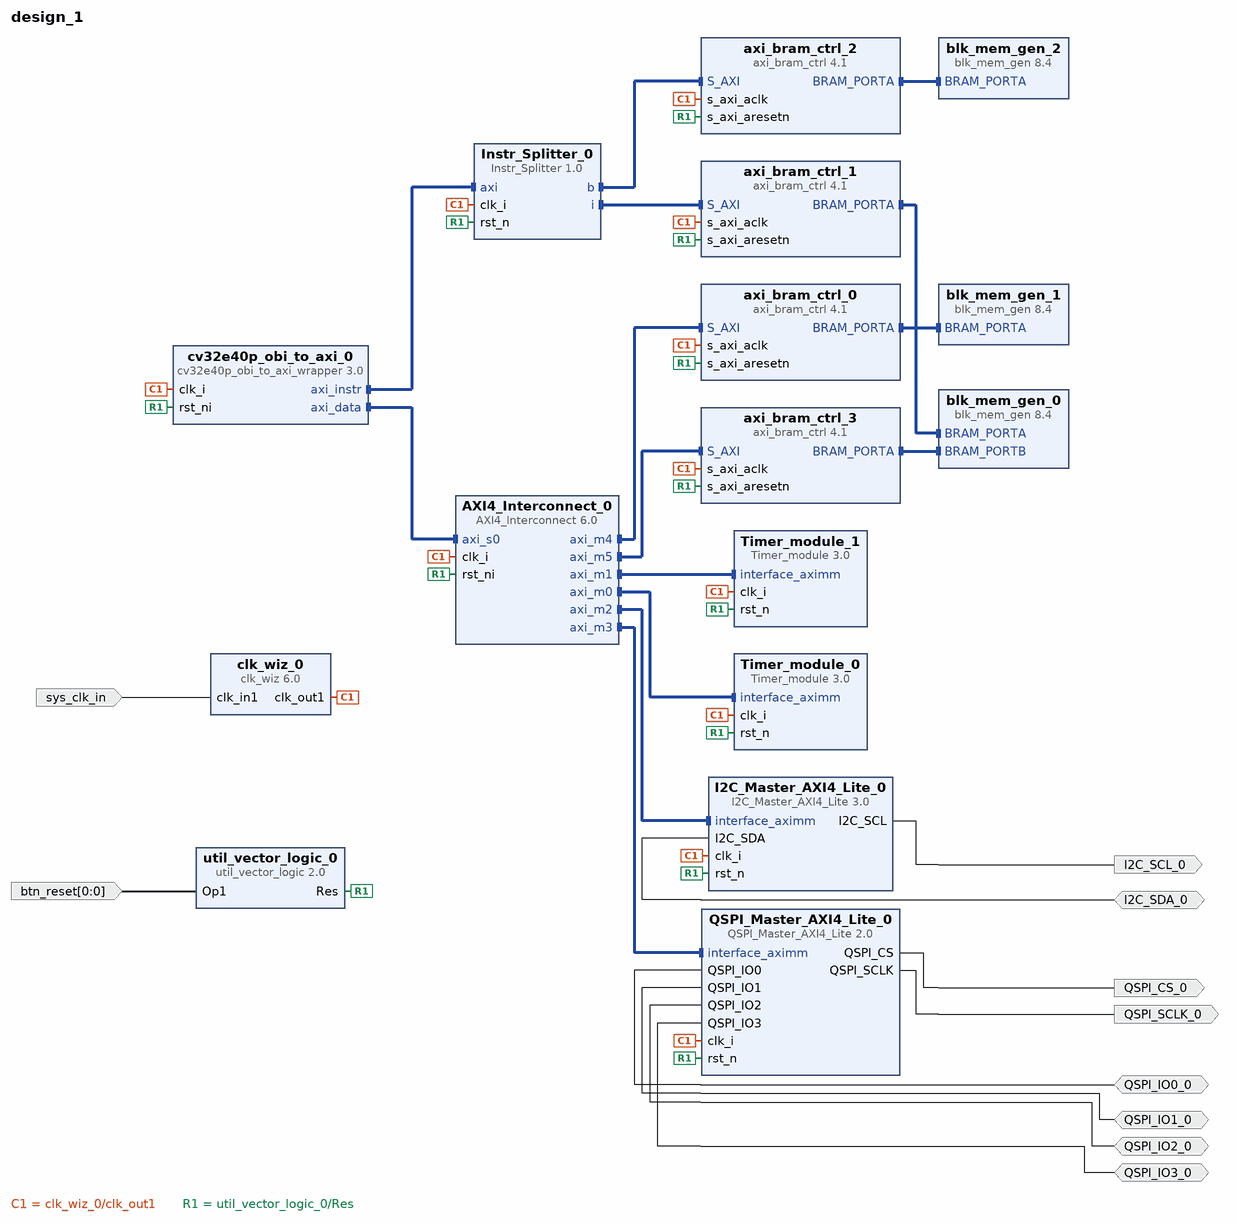
[diagram p0: block diagram of the top level]
# Vivado block design design_1, xc7a35tcpg236-1, Vivado 2025.2
create_bd_design design_1

create_bd_port -dir I -type clk sys_clk_in
create_bd_port -dir I -from 0 -to 0 btn_reset
create_bd_port -dir O I2C_SCL_0
create_bd_port -dir IO I2C_SDA_0
create_bd_port -dir O QSPI_SCLK_0
create_bd_port -dir O QSPI_CS_0
create_bd_port -dir IO QSPI_IO0_0
create_bd_port -dir IO QSPI_IO1_0
create_bd_port -dir IO QSPI_IO2_0
create_bd_port -dir IO QSPI_IO3_0

create_bd_cell -type ip -vlnv kyber:user:cv32e40p_obi_to_axi_wrapper:3.0 cv32e40p_obi_to_axi_0
set_property -dict {CONFIG.boot_addr 0x00000000} [get_bd_cells cv32e40p_obi_to_axi_0]
create_bd_cell -type ip -vlnv kyber:user:AXI4_Interconnect:6.0 AXI4_Interconnect_0
create_bd_cell -type ip -vlnv xilinx.com:ip:axi_bram_ctrl:4.1 axi_bram_ctrl_0
set_property -dict {CONFIG.SINGLE_PORT_BRAM 1} [get_bd_cells axi_bram_ctrl_0]
create_bd_cell -type ip -vlnv xilinx.com:ip:axi_bram_ctrl:4.1 axi_bram_ctrl_1
set_property -dict {CONFIG.SINGLE_PORT_BRAM 1} [get_bd_cells axi_bram_ctrl_1]
create_bd_cell -type ip -vlnv kyber:user:QSPI_Master_AXI4_Lite:2.0 QSPI_Master_AXI4_Lite_0
create_bd_cell -type ip -vlnv kyber:user:I2C_Master_AXI4_Lite:3.0 I2C_Master_AXI4_Lite_0
create_bd_cell -type ip -vlnv kyber:user:Timer_module:3.0 Timer_module_0
create_bd_cell -type ip -vlnv xilinx.com:ip:clk_wiz:6.0 clk_wiz_0
set_property -dict [list \
  CONFIG.CLKOUT1_JITTER 151.636 \
  CONFIG.CLKOUT1_REQUESTED_OUT_FREQ 50.000 \
  CONFIG.MMCM_CLKOUT0_DIVIDE_F 20.000 \
  CONFIG.USE_LOCKED false \
  CONFIG.USE_RESET false \
] [get_bd_cells clk_wiz_0]
create_bd_cell -type ip -vlnv xilinx.com:ip:util_vector_logic:2.0 util_vector_logic_0
set_property -dict {CONFIG.C_OPERATION not CONFIG.C_SIZE 1} [get_bd_cells util_vector_logic_0]
create_bd_cell -type ip -vlnv xilinx.com:ip:blk_mem_gen:8.4 blk_mem_gen_0
set_property -dict {CONFIG.Memory_Type True_Dual_Port_RAM} [get_bd_cells blk_mem_gen_0]
create_bd_cell -type ip -vlnv xilinx.com:ip:blk_mem_gen:8.4 blk_mem_gen_1
create_bd_cell -type ip -vlnv kyber:user:Instr_Splitter:1.0 Instr_Splitter_0
create_bd_cell -type ip -vlnv xilinx.com:ip:axi_bram_ctrl:4.1 axi_bram_ctrl_2
set_property -dict {CONFIG.PROTOCOL AXI4 CONFIG.SINGLE_PORT_BRAM 1} [get_bd_cells axi_bram_ctrl_2]
create_bd_cell -type ip -vlnv xilinx.com:ip:blk_mem_gen:8.4 blk_mem_gen_2
create_bd_cell -type ip -vlnv xilinx.com:ip:axi_bram_ctrl:4.1 axi_bram_ctrl_3
set_property -dict {CONFIG.PROTOCOL AXI4 CONFIG.SINGLE_PORT_BRAM 1} [get_bd_cells axi_bram_ctrl_3]
create_bd_cell -type ip -vlnv kyber:user:Timer_module:3.0 Timer_module_1

# ---- connections ----

connect_bd_intf_net [get_bd_intf_pins Timer_module_0/interface_aximm] [get_bd_intf_pins AXI4_Interconnect_0/axi_m0]
connect_bd_intf_net [get_bd_intf_pins Timer_module_1/interface_aximm] [get_bd_intf_pins AXI4_Interconnect_0/axi_m1]
connect_bd_intf_net [get_bd_intf_pins I2C_Master_AXI4_Lite_0/interface_aximm] [get_bd_intf_pins AXI4_Interconnect_0/axi_m2]
connect_bd_intf_net [get_bd_intf_pins QSPI_Master_AXI4_Lite_0/interface_aximm] [get_bd_intf_pins AXI4_Interconnect_0/axi_m3]
connect_bd_intf_net [get_bd_intf_pins AXI4_Interconnect_0/axi_m4] [get_bd_intf_pins axi_bram_ctrl_0/S_AXI]
connect_bd_intf_net [get_bd_intf_pins axi_bram_ctrl_3/S_AXI] [get_bd_intf_pins AXI4_Interconnect_0/axi_m5]
connect_bd_intf_net [get_bd_intf_pins Instr_Splitter_0/b] [get_bd_intf_pins axi_bram_ctrl_2/S_AXI]
connect_bd_intf_net [get_bd_intf_pins Instr_Splitter_0/i] [get_bd_intf_pins axi_bram_ctrl_1/S_AXI]
connect_bd_intf_net [get_bd_intf_pins blk_mem_gen_1/BRAM_PORTA] [get_bd_intf_pins axi_bram_ctrl_0/BRAM_PORTA]
connect_bd_intf_net [get_bd_intf_pins blk_mem_gen_0/BRAM_PORTA] [get_bd_intf_pins axi_bram_ctrl_1/BRAM_PORTA]
connect_bd_intf_net [get_bd_intf_pins axi_bram_ctrl_2/BRAM_PORTA] [get_bd_intf_pins blk_mem_gen_2/BRAM_PORTA]
connect_bd_intf_net [get_bd_intf_pins axi_bram_ctrl_3/BRAM_PORTA] [get_bd_intf_pins blk_mem_gen_0/BRAM_PORTB]
connect_bd_intf_net [get_bd_intf_pins cv32e40p_obi_to_axi_0/axi_data] [get_bd_intf_pins AXI4_Interconnect_0/axi_s0]
connect_bd_intf_net [get_bd_intf_pins Instr_Splitter_0/axi] [get_bd_intf_pins cv32e40p_obi_to_axi_0/axi_instr]
connect_bd_net [get_bd_pins I2C_Master_AXI4_Lite_0/I2C_SCL] [get_bd_ports I2C_SCL_0]
connect_bd_net [get_bd_pins clk_wiz_0/clk_out1] \
  [get_bd_pins axi_bram_ctrl_1/s_axi_aclk] [get_bd_pins I2C_Master_AXI4_Lite_0/clk_i] \
  [get_bd_pins QSPI_Master_AXI4_Lite_0/clk_i] [get_bd_pins cv32e40p_obi_to_axi_0/clk_i] \
  [get_bd_pins axi_bram_ctrl_2/s_axi_aclk] [get_bd_pins Instr_Splitter_0/clk_i] [get_bd_pins axi_bram_ctrl_3/s_axi_aclk] \
  [get_bd_pins Timer_module_0/clk_i] [get_bd_pins Timer_module_1/clk_i] [get_bd_pins axi_bram_ctrl_0/s_axi_aclk] \
  [get_bd_pins AXI4_Interconnect_0/clk_i]
connect_bd_net [get_bd_pins util_vector_logic_0/Res] \
  [get_bd_pins QSPI_Master_AXI4_Lite_0/rst_n] [get_bd_pins axi_bram_ctrl_1/s_axi_aresetn] [get_bd_pins Timer_module_0/rst_n] \
  [get_bd_pins I2C_Master_AXI4_Lite_0/rst_n] [get_bd_pins cv32e40p_obi_to_axi_0/rst_ni] \
  [get_bd_pins axi_bram_ctrl_2/s_axi_aresetn] [get_bd_pins Instr_Splitter_0/rst_n] \
  [get_bd_pins axi_bram_ctrl_3/s_axi_aresetn] [get_bd_pins Timer_module_1/rst_n] [get_bd_pins axi_bram_ctrl_0/s_axi_aresetn] \
  [get_bd_pins AXI4_Interconnect_0/rst_ni]
connect_bd_net [get_bd_ports I2C_SDA_0] [get_bd_pins I2C_Master_AXI4_Lite_0/I2C_SDA]
connect_bd_net [get_bd_ports QSPI_IO0_0] [get_bd_pins QSPI_Master_AXI4_Lite_0/QSPI_IO0]
connect_bd_net [get_bd_ports QSPI_IO1_0] [get_bd_pins QSPI_Master_AXI4_Lite_0/QSPI_IO1]
connect_bd_net [get_bd_ports QSPI_IO2_0] [get_bd_pins QSPI_Master_AXI4_Lite_0/QSPI_IO2]
connect_bd_net [get_bd_ports QSPI_IO3_0] [get_bd_pins QSPI_Master_AXI4_Lite_0/QSPI_IO3]
connect_bd_net -net Op1_0_1 [get_bd_ports btn_reset] [get_bd_pins util_vector_logic_0/Op1]
connect_bd_net [get_bd_pins QSPI_Master_AXI4_Lite_0/QSPI_CS] [get_bd_ports QSPI_CS_0]
connect_bd_net [get_bd_pins QSPI_Master_AXI4_Lite_0/QSPI_SCLK] [get_bd_ports QSPI_SCLK_0]
connect_bd_net -net clk_in1_0_1 [get_bd_ports sys_clk_in] [get_bd_pins clk_wiz_0/clk_in1]

validate_bd_design
save_bd_design
